# Altium schematic sheet m058.SchDoc
size A3
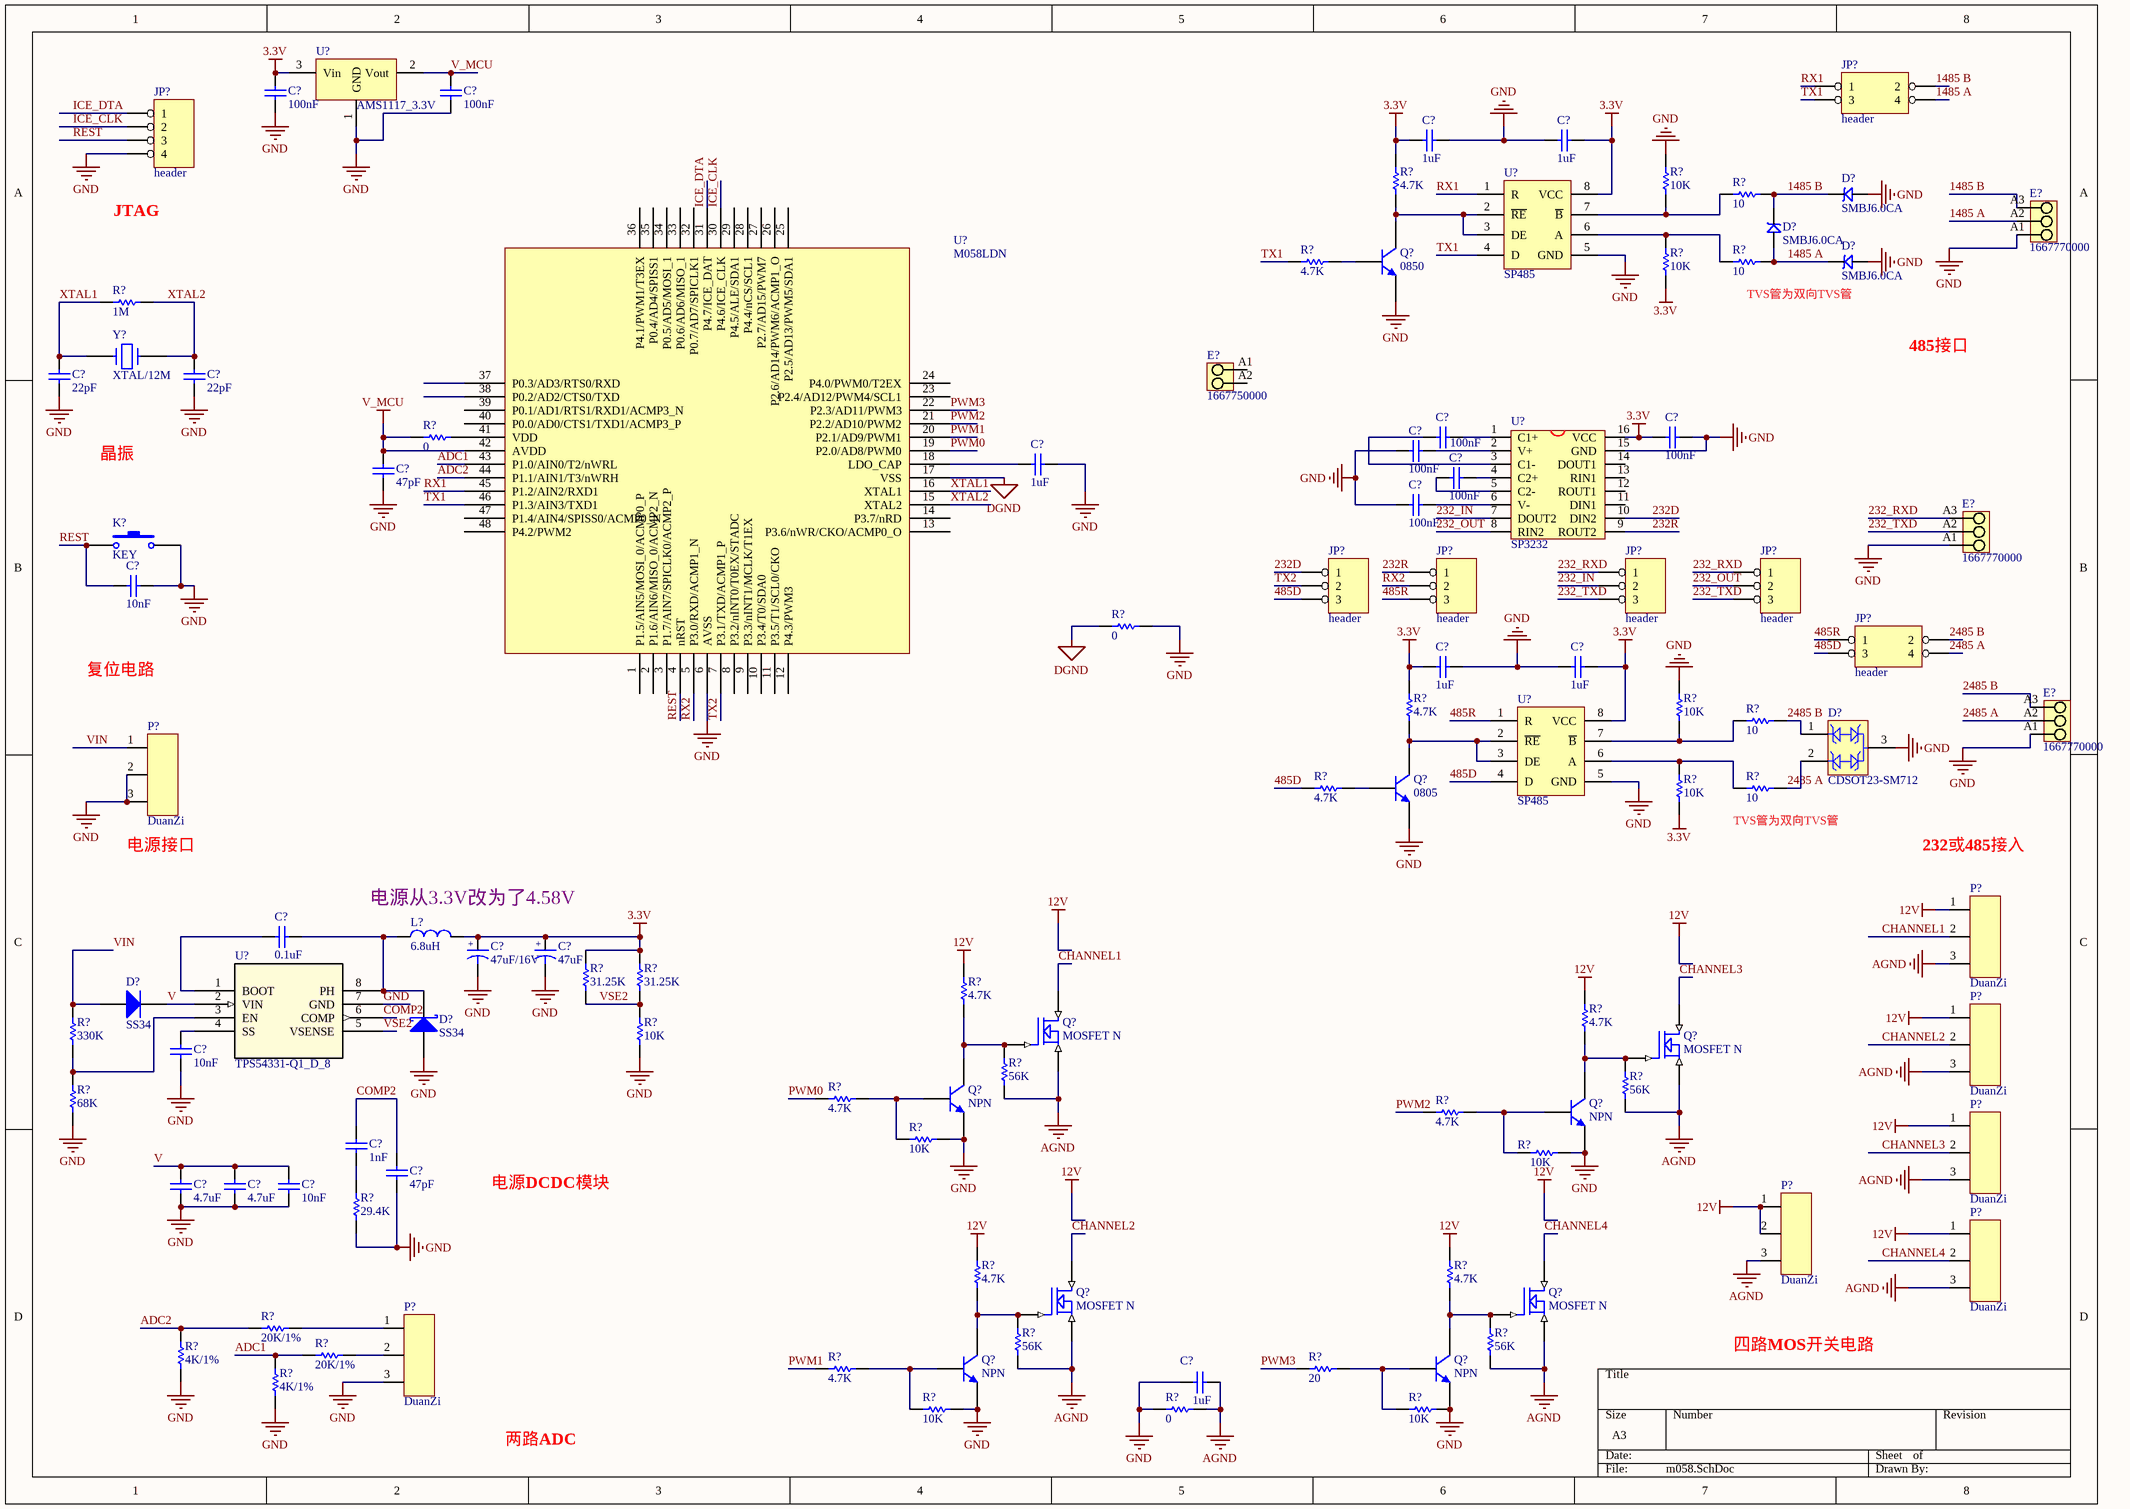
[diagram p0: m058.SchDoc]

## Parts
(Parts that share a designator on the sheet are numbered #1, #2 ... from top to bottom, then left to right.)
C?#1  100nF  [0805_c]
C?#2  100nF  [0805_c]
C?#3  1uF  [0805_c]
C?#4  1uF  [0805_c]
C?#5  22pF  [0805_c]
C?#6  22pF  [0805_c]
C?#7  100nF  [0805_c]
C?#8  100nF  [0805_c]
C?#9  100nF  [0805_c]
C?#10  1uF  [0805_c]
C?#11  47pF  [0805_c]
C?#12  100nF  [0805_c]
C?#13  100nF  [0805_c]
C?#14  10nF  [0805_c]
C?#15  1uF  [0805_c]
C?#16  1uF  [0805_c]
C?#17  0.1uF  [0805_c]
C?#18  47uF/16V  [CC6.56.5]
C?#19  47uF  [CC6.56.5]
C?#20  10nF  [0805_c]
C?#21  1nF  [0805_c]
C?#22  47pF  [0805_c]
C?#23  4.7uF  [0805_c]
C?#24  4.7uF  [0805_c]
C?#25  10nF  [0805_c]
C?#26  1uF  [0805_c]
D?#1  SMBJ6.0CA  [SMBJ]
D?#2  SMBJ6.0CA  [SMBJ]
D?#3  SMBJ6.0CA  [SMBJ]
D?#4  CDSOT23-SM712  [BOUR-SOT23-3_V]
D?#5  SS34  [SMC]
D?#6  SS34  [SMB]
E?#1  1667770000  [LM_3_5_90_03]
E?#2  1667750000  [LM_3_5_90_02]
E?#3  1667770000  [LM_3_5_90_03]
E?#4  1667770000  [LM_3_5_90_03]
JP?#1  header  [header2X2]
JP?#2  header  [header4]
JP?#3  header  [header3]
JP?#4  header  [header3]
JP?#5  header  [header3]
JP?#6  header  [header3]
JP?#7  header  [header2X2]
K?  KEY  [KEY_2]
L?  6.8uH  [L_3]
P?#1  DuanZi  [DG128-3]
P?#2  DuanZi  [DG128-3]
P?#3  DuanZi  [DG128-3]
P?#4  DuanZi  [DG128-3]
P?#5  DuanZi  [DG128-3]
P?#6  DuanZi  [DG128-3]
P?#7  DuanZi  [DG128-3]
Q?#1  0850  [SOT23_3]
Q?#2  0805  [SOT23_3]
Q?#3  MOSFET N  [TO-252]
Q?#4  MOSFET N  [TO-252]
Q?#5  NPN  [SOT-23B_L]
Q?#6  NPN  [SOT-23B_L]
Q?#7  MOSFET N  [TO-252]
Q?#8  MOSFET N  [TO-252]
Q?#9  NPN  [SOT-23B_L]
Q?#10  NPN  [SOT-23B_L]
R?#1  10  [0603_R]
R?#2  4.7K  [0603_R]
R?#3  10K  [0603_R]
R?#4  4.7K  [0603_R]
R?#5  10  [0603_R]
R?#6  10K  [0603_R]
R?#7  1M  [0603_R]
R?#8  0  [0603_R]
R?#9  0  [0603_R]
R?#10  10  [0603_R]
R?#11  4.7K  [0603_R]
R?#12  10K  [0603_R]
R?#13  4.7K  [0603_R]
R?#14  10  [0603_R]
R?#15  10K  [0603_R]
R?#16  31.25K  [0603_R]
R?#17  31.25K  [0603_R]
R?#18  4.7K  [0603_R]
R?#19  4.7K  [0603_R]
R?#20  330K  [0603_R]
R?#21  10K  [0603_R]
R?#22  56K  [0603_R]
R?#23  56K  [0603_R]
R?#24  68K  [0603_R]
R?#25  4.7K  [0603_R]
R?#26  4.7K  [0603_R]
R?#27  10K  [0603_R]
R?#28  10K  [0603_R]
R?#29  29.4K  [0603_R]
R?#30  4.7K  [0603_R]
R?#31  4.7K  [0603_R]
R?#32  20K/1%  [0603_R]
R?#33  56K  [0603_R]
R?#34  56K  [0603_R]
R?#35  4K/1%  [0603_R]
R?#36  20K/1%  [0603_R]
R?#37  4.7K  [0603_R]
R?#38  20  [0603_R]
R?#39  4K/1%  [0603_R]
R?#40  0  [0603_R]
R?#41  10K  [0603_R]
R?#42  10K  [0603_R]
U?#1  AMS1117_3.3V  [SOT-223]
U?#2  SP485  [SOIC-8]
U?#3  M058LDN  [LQFP48]
U?#4  SP3232  [SOP16M]
U?#5  SP485  [SOIC-8]
U?#6  TPS54331-Q1_D_8  [D8-M]
Y?  XTAL/12M  [XTAL_2]

## Nets
3.3V: C?#1.2 C?#3.1 C?#4.2 C?#8.1 C?#15.1 C?#16.2 C?#18.1 C?#19.1 L?.2 R?#2.2 R?#6.1 R?#11.2 R?#15.1 R?#16.2 R?#17.2 U?#1.3(Vin) U?#2.8(VCC) U?#4.16(VCC) U?#5.8(VCC)
12V: P?#2.1 P?#3.1 P?#4.1 P?#5.1 P?#5.2 P?#6.1 R?#18.2 R?#19.2 R?#30.1 R?#31.1
AGND: C?#26.2 P?#2.3 P?#3.3 P?#4.3 P?#5.3 P?#6.3 Q?#3.3(S) Q?#4.3(S) Q?#7.3(S) Q?#8.3(S) R?#22.1 R?#23.1 R?#33.1 R?#34.1 R?#40.2
DGND: R?#9.1 U?#3.17(VSS)
GND: C?#1.1 C?#2.1 C?#3.2 C?#4.1 C?#5.1 C?#6.1 C?#8.2 C?#9.1 C?#10.2 C?#11.2 C?#13.1 C?#14.2 C?#15.2 C?#16.1 C?#18.2 C?#19.2 C?#20.1 C?#22.2 C?#23.1 C?#24.1 C?#25.1 C?#26.1 D?#1.1 D?#3.1 D?#4.3 D?#6.1(A) E?#1.A1 E?#3.A1 E?#4.A1 JP?#2.4 K?.2 P?#1.2 P?#1.3 P?#7.3 Q?#1.3(E) Q?#2.3(E) Q?#5.3(E) Q?#6.3(E) Q?#9.3(E) Q?#10.3(E) R?#3.2 R?#9.2 R?#12.2 R?#21.1 R?#24.1 R?#27.1 R?#28.1 R?#29.2 R?#35.1 R?#39.1 R?#40.1 R?#41.1 R?#42.1 U?#1.1(GND) U?#2.5(GND) U?#3.6(AVSS) U?#4.15(GND) U?#5.5(GND) U?#6.7(GND)
V_MCU: C?#2.2 C?#11.1 R?#8.1 U?#1.2(Vout) U?#3.42(AVDD)
232_IN: JP?#5.2 U?#4.7(DOUT2)
232_OUT: JP?#6.2 U?#4.8(RIN2)
232_RXD: E?#3.A3 JP?#5.1 JP?#6.1
232_TXD: E?#3.A2 JP?#5.3 JP?#6.3
232D: JP?#3.1 U?#4.10(DIN2)
232R: JP?#4.1 U?#4.9(ROUT2)
485D: JP?#3.3 JP?#7.3 R?#13.1 U?#5.4(D)
485R: JP?#4.3 JP?#7.1 U?#5.1(R)
1485 A: D?#2.1 D?#3.2 E?#1.A2 JP?#1.4 R?#5.2
1485 B: D?#1.2 D?#2.2 E?#1.A3 JP?#1.2 R?#1.2
2485 A: D?#4.2 E?#4.A2 JP?#7.4 R?#14.2
2485 B: D?#4.1 E?#4.A3 JP?#7.2 R?#10.2
ADC1: R?#36.2 R?#39.2 U?#3.43(P1.0/AIN0/T2/nWRL)
ADC2: R?#32.2 R?#35.2 U?#3.44(P1.1/AIN1/T3/nWRH)
CHANNEL1: P?#2.2 Q?#3.2(D)
CHANNEL2: P?#3.2 Q?#7.2(D)
CHANNEL3: P?#4.2 Q?#4.2(D)
CHANNEL4: P?#6.2 Q?#8.2(D)
COMP2: C?#21.2 C?#22.1 U?#6.6(COMP)
ICE_CLK: JP?#2.2 U?#3.30(P4.6/ICE_CLK)
ICE_DTA: JP?#2.1 U?#3.31(P4.7/ICE_DAT)
PWM0: R?#25.2 U?#3.19(P2.0/AD8/PWM0)
PWM1: R?#37.2 U?#3.20(P2.1/AD9/PWM1)
PWM2: R?#26.2 U?#3.21(P2.2/AD10/PWM2)
PWM3: R?#38.2 U?#3.22(P2.3/AD11/PWM3)
REST: C?#14.1 JP?#2.3 K?.1 U?#3.4(nRST)
RX1: JP?#1.1 U?#2.1(R) U?#3.45(P1.2/AIN2/RXD1)
RX2: JP?#4.2 U?#3.5(P3.0/RXD/ACMP1_N)
TX1: JP?#1.3 R?#4.1 U?#2.4(D) U?#3.46(P1.3/AIN3/TXD1)
TX2: JP?#3.2 U?#3.7(P3.1/TXD/ACMP1_P)
V: C?#23.2 C?#24.2 C?#25.2 D?#5.2(K) U?#6.2(VIN)
VIN: D?#5.1(A) P?#1.1 R?#20.2
VSE2: R?#16.1 R?#17.1 R?#21.2 U?#6.5(VSENSE)
XTAL1: C?#5.2 R?#7.1 U?#3.16(XTAL1) Y?.1
XTAL2: C?#6.2 R?#7.2 U?#3.15(XTAL2) Y?.2
NetC?#7_1: C?#7.1 U?#4.3(C1-)
NetC?#7_2: C?#7.2 U?#4.1(C1+)
NetC?#9_2: C?#9.2 U?#4.2(V+)
NetC?#10_1: C?#10.1 U?#3.18(LDO_CAP)
NetC?#12_1: C?#12.1 U?#4.5(C2-)
NetC?#12_2: C?#12.2 U?#4.4(C2+)
NetC?#13_2: C?#13.2 U?#4.6(V-)
NetC?#17_1: C?#17.1 U?#6.1(BOOT)
NetC?#17_2: C?#17.2 D?#6.2(K) L?.1 U?#6.8(PH)
NetC?#20_2: C?#20.2 U?#6.4(SS)
NetC?#21_1: C?#21.1 R?#29.1
NetP?#7_1: P?#7.1 R?#32.1
NetP?#7_2: P?#7.2 R?#36.1
NetQ?#1_1: Q?#1.1(C) R?#2.1 U?#2.2(~{RE}) U?#2.3(DE)
NetQ?#1_2: Q?#1.2(B) R?#4.2
NetQ?#2_1: Q?#2.1(C) R?#11.1 U?#5.2(~{RE}) U?#5.3(DE)
NetQ?#2_2: Q?#2.2(B) R?#13.2
NetQ?#3_1: Q?#3.1(G) Q?#5.1(C) R?#18.1 R?#22.2
NetQ?#4_1: Q?#4.1(G) Q?#6.1(C) R?#19.1 R?#23.2
NetQ?#5_2: Q?#5.2(B) R?#25.1 R?#27.2
NetQ?#6_2: Q?#6.2(B) R?#26.1 R?#28.2
NetQ?#7_1: Q?#7.1(G) Q?#9.1(C) R?#30.2 R?#33.2
NetQ?#8_1: Q?#8.1(G) Q?#10.1(C) R?#31.2 R?#34.2
NetQ?#9_2: Q?#9.2(B) R?#37.1 R?#41.2
NetQ?#10_2: Q?#10.2(B) R?#38.1 R?#42.2
NetR?#1_1: R?#1.1 R?#3.1 U?#2.7(~{B})
NetR?#5_1: R?#5.1 R?#6.2 U?#2.6(A)
NetR?#8_2: R?#8.2 U?#3.41(VDD)
NetR?#10_1: R?#10.1 R?#12.1 U?#5.7(~{B})
NetR?#14_1: R?#14.1 R?#15.2 U?#5.6(A)
NetR?#20_1: R?#20.1 R?#24.2 U?#6.3(EN)

Not connected (* = marked no-connect by the designer): E?#2 A1 A2; U?#3 1(P1.5/AIN5/MOSI_0/ACMP0_P) 2(P1.6/AIN6/MISO_0/ACMP2_N) 3(P1.7/AIN7/SPICLK0/ACMP2_P) 8(P3.2/nINT0/T0EX/STADC) 9(P3.3/nINT1/MCLK/T1EX) 10(P3.4/T0/SDA0) 11(P3.5/T1/SCL0/CKO) 12(P4.3/PWM3) 13(P3.6/nWR/CKO/ACMP0_O) 14(P3.7/nRD) 23(P2.4/AD12/PWM4/SCL1) 24(P4.0/PWM0/T2EX) 25(P2.5/AD13/PWM5/SDA1) 26(P2.6/AD14/PWM6/ACMP1_O) 27(P2.7/AD15/PWM7) 28(P4.4/nCS/SCL1) 29(P4.5/ALE/SDA1) 32(P0.7/AD7/SPICLK1) 33(P0.6/AD6/MISO_1) 34(P0.5/AD5/MOSI_1) 35(P0.4/AD4/SPISS1) 36(P4.1/PWM1/T3EX) 37(P0.3/AD3/RTS0/RXD) 38(P0.2/AD2/CTS0/TXD) 39(P0.1/AD1/RTS1/RXD1/ACMP3_N) 40(P0.0/AD0/CTS1/TXD1/ACMP3_P) 47(P1.4/AIN4/SPISS0/ACMP0_N) 48(P4.2/PWM2); U?#4 11(DIN1) 12(ROUT1) 13(RIN1) 14(DOUT1)

## Notes on the sheet
- (near JP?#2) JTAG
- TVS管为双向TVS管
- 485接口
- 晶振
- 复位电路
- (near P?#1) 电源接口
- (near R?#14) TVS管为双向TVS管
- 232或485接入
- 电源从3.3V改为了4.58V
- 电源DCDC模块
- 四路MOS开关电路
- 两路ADC
- (in symbol CAP1) +

## Library data of the parts
C?#1-C?#17 C?#20-C?#26 = CAP: Capacitor; Value: 104; Published: 8-Jun-2000; LatestRevisionDate: 17-Jul-2002; LatestRevisionNote: Re-released for DXP Platform.; PackageReference: RAD-0.3; Publisher: Altium Limited
C?#18 C?#19 = CAP1
D?#1-D?#3 = SMBJ: TVS
D?#4 = CMP-2000-05081-1: Surface Mount TVS Diode, 17 A Ipp, -55 to 150 degC, 3-Pin SOT23, RoHS, Tape and Reel; Manufacturer: Bourns; Catalog Drawings: CDSOT23-SM712Schematic; Current - Peak Pulse (10/1000µs): 17A(8/20µs); Voltage - Breakdown (Min): 7.5V,13.3V; Online Catalog: CDSOT23Series; Power Line Protection: No; Bidirectional Channels: 2; Type: Zener; For Use With: EVAL-CN0313-SDPZ-ND-EVALEMCRS-485CERTIFIED; Kits: PN-DESIGNKIT-22-ND-KITESD/EFTSURGEPROTECTION; Capacitance @ Frequency: 75pF@1MHz; Product Training Modules: ESDProtectionProducts; Voltage - Clamping (Max) @ Ipp: 14V,26V; Voltage - Reverse Standoff (Typ): 7V(Max),12V(Max); Related Products: ADM3485EARZ-REEL7TR-ND-ICTXRXRS-485HS3.3V8SOICADM3485EARZ-REEL7CT-ND-ICTXRXRS-485HS3.3V8SOICADM3485EARZ-REEL7DKR-ND-ICTXRXRS-485HS3.3V8SOICADM3485EARZ-ND-ICTX/RXRS-485HS3.3V8-SOICADM3485EAR-ND-ICTX/RXRS-485HS3.3V8-SOIC296-38503-5-ND-ICTXRXRS4853.3VESD14SOIC296-38501-5-ND-ICRS485TXRX3.3ESD8SOIC296-38522-5-ND-ICTXRXRS4853.3V14SOIC296-38502-5-ND-ICTXRXRS4853.3VESD14SOICADM3485EARZ-REELTR-ND-ICTXRXRS-4853.3V8SOICADM3485EARZ-REELCT-ND-ICTXRXRS-4853.3V8SOICADM3485EARZ-REELDKR-ND-ICTXRXRS-4853.3V8SOIC296-40517-2-ND-ICTXRXRS4853.3V14SOIC296-40517-1-ND-ICTXRXRS4853.3V14SOIC296-40517-6-ND-ICTXRXRS4853.3V14SOIC296-40519-2-ND-ICRS485TXRX3.3ESD8SOIC296-40519-1-ND-ICRS485TXRX3.3ESD8SOIC296-40519-6-ND-ICRS485TXRX3.3ESD8SOIC296-40524-2-ND-ICTXRXRS4853.3VESD8SOIC296-40524-1-ND-ICTXRXRS4853.3VESD8SOIC296-40524-6-ND-ICTXRXRS4853.3VESD8SOIC296-40522-2-ND-ICTXRXRS4853.3VESD14SOIC296-40522-1-ND-ICTXRXRS4853.3VESD14SOIC296-40522-6-ND-ICTXRXRS4853.3VESD14SOIC296-40529-2-ND-ICRS485TXRX3.3ESD8SOIC296-40529-1-ND-ICRS485TXRX3.3ESD8SOIC2; Other Names: CDSOT23-SM712CT; Power - Peak Pulse: 400W; Applications: GeneralPurpose; Supplier Device Package: SOT-23-3; Package / Case: TO-236-3,SC-59,SOT-23-3; Mounting Type: SurfaceMount; Datasheet URL: https://datasheet.ciiva.com/11193/cdsot23-sm712-11193846.pdf; Standard Package: 1; Series: -; Category: CircuitProtection; Unidirectional Channels: -; Package Description: 3-Lead Small Out-Line Transistor, Body 2.9x1.3mm, Pitch 0.95mm; Family: TVS-Diodes; Datasheet Version: Aug-12; Manufacturer URL: http://www.bourns.com/; Operating Temperature: -55degC~150degC(TJ); Packaging: CutTape(CT)
D?#5 = Diode: Default Diode; Published: 8-Jun-2000; LatestRevisionDate: 17-Jul-2002; LatestRevisionNote: Re-released for DXP Platform.; PackageVersion: Sep-1996; PackageReference: SMC; Publisher: Altium Limited; PackageDescription: DO-214-AB/SMC; 2 C-Bend Leads; Body 7.9 x 5.9 mm, inc. leads (LxW); Code_JEDEC: DO-214-AB
D?#6 = D Schottky: Schottky Diode; Published: 8-Jun-2000; LatestRevisionDate: 17-Jul-2002; LatestRevisionNote: Re-released for DXP Platform.; PackageReference: SMB; Publisher: Altium Limited; PackageDescription: DO-214-AA/SMB; 2 C-Bend Leads; Body 5.3 x 3.6 mm, inc. leads (LxW); Code_JEDEC: DO-214-AA
E?#1 E?#3 E?#4 = CMP-1559-01729-1: OMNIMATE Signal - series LM; Manufacturer: Weidmueller; Contact_material: Cu-Leg; Contact_surface: tinned; Rated_current_use_group_B_UL_1059: 10 A; Insulating_material: PA; Wire_cross_section_AWG_min_UL_1059: AWG 28; Short_text_for_material: LM 3.50/03/90 3.2SN OR BX; Solid_max_H05_07_V_U: 1,5 mm²; Rated_current_min_no_of_poles_TU_20_deg_C: 32 A; Solder_pin_length_mm: 3,2 mm; Mounting_onto_the_PCB: Solder connection; Wire_cross_section_AWG_max_UL_1059: AWG 14; No_of_poles: 3; Rated_voltage_use_group_B_UL_1059: 300 V; Side_termination_characteristic: closed side; Rated_voltage_for_surge_voltage_class_pollution_degree_II_2: 320 V; UL_94_flammability_rating: V-2; Pitch_mm: 3,5 mm; Pitch_inch: 0,138 inch; Solid_min_H05_07_V_U: 0,5 mm²; ComponentLink2URL: http://catalog.weidmueller.com/catalog/Start.do?localeId=en&ObjectID=1667770000; Revision: V1; ComponentLink2Description: URL Link1; Packaging: Box; Colour: Orange; ComponentLink1Description: Manufacturer URL; PackageReference: LM_3_5_90_03; Qty: 100 PCS; PartNumber: 1667770000; ComponentLink1URL: http://www.weidmueller.com/
E?#2 = CMP-1559-01728-1: OMNIMATE Signal - series LM; Manufacturer: Weidmueller; Rated_voltage_for_surge_voltage_class_pollution_degree_II_2: 320 V; Rated_current_use_group_B_UL_1059: 10 A; Short_text_for_material: LM 3.50/02/90 3.2SN OR BX; UL_94_flammability_rating: V-2; Solid_min_H05_07_V_U: 0,5 mm²; Pitch_mm: 3,5 mm; Solid_max_H05_07_V_U: 1,5 mm²; Rated_voltage_use_group_B_UL_1059: 300 V; Wire_cross_section_AWG_min_UL_1059: AWG 28; Contact_material: Cu-Leg; Rated_current_min_no_of_poles_TU_20_deg_C: 32 A; Contact_surface: tinned; Mounting_onto_the_PCB: Solder connection; Wire_cross_section_AWG_max_UL_1059: AWG 14; No_of_poles: 2; Pitch_inch: 0,138 inch; Solder_pin_length_mm: 3,2 mm; Side_termination_characteristic: closed side; Insulating_material: PA; Revision: V1; ComponentLink1Description: Manufacturer URL; PartNumber: 1667750000; ComponentLink2URL: http://catalog.weidmueller.com/catalog/Start.do?localeId=en&ObjectID=1667750000; PackageReference: LM_3_5_90_02; Qty: 100 PCS; Colour: Orange; ComponentLink2Description: URL Link1; Packaging: Box; ComponentLink1URL: http://www.weidmueller.com/
JP?#1 JP?#7 = HEADER 2X2
JP?#2 = HEADER 4
JP?#3-JP?#6 = HEADER 3
K? = KEY_2: Switch; Published: 24-Mar-1999; LatestRevisionDate: 17-Jul-2002; LatestRevisionNote: Re-released for DXP Platform.; PackageReference: SPST-2; Publisher: Altium Limited
L? = L_Inductance
P?#1-P?#7 = 接线端子_3
Q?#1 Q?#2 Q?#5 Q?#6 Q?#9 Q?#10 = NPN: NPN Bipolar Transistor; pin to pad: 1>3 2>1 3>2; Published: 8-Jun-2000; LatestRevisionDate: 17-Jul-2002; LatestRevisionNote: Re-released for DXP Platform.; PackageReference: TO-226-AA; Publisher: Altium Limited; PackageDescription: TO, Flat Index; 3 In-Line, Axial Leads; Body Dia. 4.8mm; Leads 0.55 x 0.51 mm (max); Code_JEDEC: TO-226-AA
R?#1-R?#42 = RES: Resistor; Value: 1K; Published: 8-Jun-2000; Revision: July-2002: Re-released for DXP Platform.; Publisher: Altium Limited
U?#1 = AMS1117: 3.3V电压转换器AMS1117
U?#4 = MAX3232
U?#6 = TPS54331-Q1_D_8: Imported; Vendor: Texas Instruments; PACKAGE_DESIGNATOR: D; PIN_COUNT: 8; FAMILY_NAME: STEP-DOWN REGULATOR; INDUSTRY_STD_PKG_TYPE: SOIC; Manufacturer_Part_Number: tps54331-q1_d_8; GENERIC_PART_NUMBER: TPS54331-Q1; Manufacturer: Texas Instruments; Datasheet_URL: http://www.ti.com/lit/gpn/TPS54331-Q1; Value: Value; Type: Type; RefDes: RefDes
Y? = XTAL: 8M
U?#3 = M058LDN: OriginalSymbolOrigin: *; M058LDN: *; Value: *